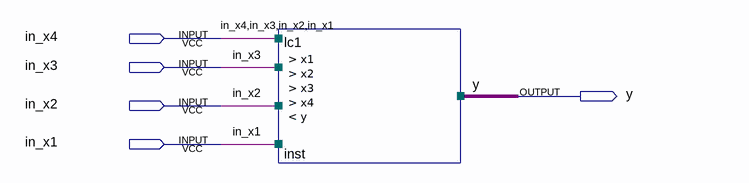
[diagram p0: schematic sheet]
// Quartus schematic lab1-ddnf.bdf as structural Verilog: 1 symbols, 5 pins
module \lab1-ddnf  (
  input  in_x4,
  input  in_x3,
  input  in_x2,
  input  in_x1,
  output y
);

  lc1 inst (.x1(in_x1), .x2(in_x2), .x3(in_x3), .x4(in_x4), .y(y));
endmodule
